# Altium schematic sheet schematic.SchDoc
size A
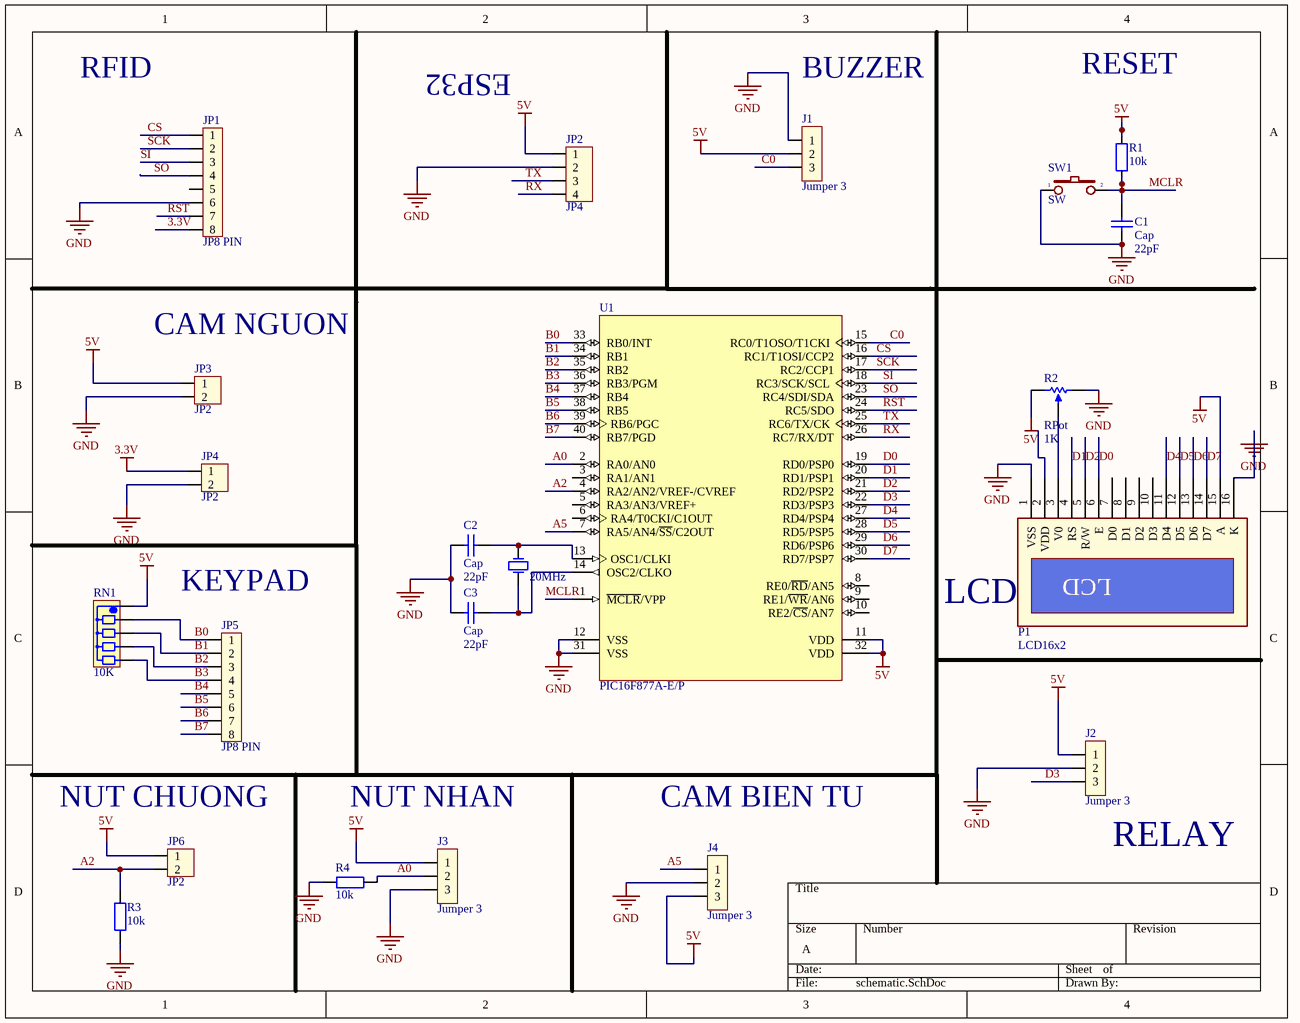
[diagram p0: schematic.SchDoc]

## Parts
C1  Cap  value 22pF  [RAD-0.3]
C2  Cap  value 22pF  [RAD-0.3]
C3  Cap  value 22pF  [RAD-0.3]
J1  Jumper 3  [JP3]
J2  Jumper 3  [JP3]
J3  Jumper 3  [JP3]
J4  Jumper 3  [JP3]
JP1  JP8 PIN  [JP8]
JP2  JP4  [CON4]
JP3  JP2  [CON2]
JP4  JP2  [CON2]
JP5  JP8 PIN  [JP8]
JP6  JP2  [CON2]
P1  LCD16x2  [LCD16X2]
R1  10k  [RES-1/4W]
R2  RPot  value 1K  [VR5]
R3  10k  [RES-1/4W]
R4  10k  [RES-1/4W]
RN1  10K  [RN4]
SW1  SW  [SW2]
U1  PIC16F877A-E/P  [DIP.100/40/W.600/L2.100]
Y1  20MHz  [XTAL]

## Nets
3.3V: JP1.8 JP4.1
5V: J1.2 J2.1 J3.1 J4.3 JP2.1 JP3.1 JP6.1 P1.15(A) R1.2 R2.1(TOP) RN1.1 U1.11(VDD) U1.32(VDD)
GND: C1.1 C2.1 C3.1 J1.1 J2.2 J3.3 J4.2 JP1.6 JP2.2 JP3.2 JP4.2 P1.1(VSS) P1.16(K) R2.2(BOT) R3.1 R4.2 SW1.1 U1.12(VSS) U1.31(VSS)
A0: J3.2 R4.1 U1.2(RA0/AN0)
A2: JP6.2 R3.2 U1.4(RA2/AN2/VREF-/CVREF)
A5: J4.1 U1.7(RA5/AN4/~{SS}/C2OUT)
B0: JP5.1 RN1.2 U1.33(RB0/INT)
B1: JP5.2 RN1.3 U1.34(RB1)
B2: JP5.3 RN1.4 U1.35(RB2)
B3: JP5.4 RN1.5 U1.36(RB3/PGM)
B4: JP5.5 U1.37(RB4)
B5: JP5.6 U1.38(RB5)
B6: JP5.7 U1.39(RB6/PGC)
B7: JP5.8 U1.40(RB7/PGD)
C0: J1.3 U1.15(RC0/T1OSO/T1CKI)
CS: JP1.1 U1.16(RC1/T1OSI/CCP2)
D0: P1.6(E) U1.19(RD0/PSP0)
D1: P1.4(RS) U1.20(RD1/PSP1)
D2: P1.5(R/W) U1.21(RD2/PSP2)
D3: J2.3 U1.22(RD3/PSP3)
D4: P1.11(D4) U1.27(RD4/PSP4)
D5: P1.12(D5) U1.28(RD5/PSP5)
D6: P1.13(D6) U1.29(RD6/PSP6)
D7: P1.14(D7) U1.30(RD7/PSP7)
MCLR: C1.2 R1.1 SW1.2 U1.1(~{MCLR}/VPP)
RST: JP1.7 U1.24(RC5/SDO)
RX: JP2.4 U1.26(RC7/RX/DT)
SCK: JP1.2 U1.17(RC2/CCP1)
SI: JP1.3 U1.18(RC3/SCK/SCL)
SO: JP1.4 U1.23(RC4/SDI/SDA)
TX: JP2.3 U1.25(RC6/TX/CK)
NetC2_2: C2.2 U1.13(OSC1/CLKI) Y1.2(OSC2)
NetC3_2: C3.2 U1.14(OSC2/CLKO) Y1.1(OSC1)
NetP1_3: P1.3(V0) R2.3(TAP)

Not connected (* = marked no-connect by the designer): JP1 5; P1 2(VDD) 7(D0) 8(D1) 9(D2) 10(D3); U1 3(RA1/AN1) 5(RA3/AN3/VREF+) 6(RA4/T0CKI/C1OUT) 8(RE0/~{RD}/AN5) 9(RE1/~{WR}/AN6) 10(RE2/~{CS}/AN7)

## Notes on the sheet
- RFID
- ESP32
- BUZZER
- RESET
- (near JP3) CAM NGUON
- KEYPAD
- LCD
- NUT CHUONG
- NUT NHAN
- CAM BIEN TU
- (near J2) RELAY
- (in symbol LCD Text) LCD

## Library data of the parts
C1-C3 = Cap: Capacitor; Published: 8-Jun-2000; LatestRevisionDate: 17-Jul-2002; LatestRevisionNote: Re-released for DXP Platform.; PackageReference: RAD-0.3; Publisher: Altium Limited; PackageDescription: Radial Cap, Thru-Hole; 2 Leads; 0.3 in Pin Spacing
J1-J4 = JP3: Value: J3
JP1 JP5 = JP8: Value: JP7
JP2 = Con4: Connector 4; Value: Connector 4
JP3 JP4 JP6 = Con2: Connector 2; Value: Connector 2
P1 = LCD Text
R1 R3 R4 = Tro 0603 1% 10k: Dán; Don_Vi: Con; So_Chan: 2; Ten_Linh_Kien: Trở 0603 1% 10k; Ma_Hang: MH006333; Chung_Loai: Dán; Kieu_Chan: *
R2 = RPot: Potentiometer; Sim Note: Enter the Resistance value and the set point into parameter fields.; Set Position: 0.5; Published: 8-Jun-2000; LatestRevisionDate: 17-Jul-2002; LatestRevisionNote: Re-released for DXP Platform.; PackageReference: VR5; Publisher: Altium Limited; PackageDescription: Variable Resistor, Thru-Hole; 3 Leads
RN1 = RN4: Resistor 4 (thanh); Value: Tro thanh 4K7
SW1 = SW2: Switch button 2 pin; Value: SW chip 2 pin
U1 = PIC16F877A-E/P: Enhanced FLASH Microcontroller, 8K (x14-Bit words) FLASH, 368 Bytes RAM, 40-Pin PDIP, Standard VDD Range, Extended Temperature; PackageDocument: 2003; Note: 25mA sink/source per I/O.; Published: 11-Oct-2004; LatestRevisionDate: 4-Mar-2005; LatestRevisionNote: Stylized 3D Model Added.; DatasheetDocument: DS39582B_2003; PackageReference: PDIP600-40; Publisher: Altium Limited; Code_JEDEC: MO-011; ComponentLink1Description: Manufacturer Link; ComponentLink1URL: http://www.microchip.com/index.asp; ComponentLink2Description: Datasheet; ComponentLink2URL: http://ww1.microchip.com/downloads/en/DeviceDoc/39582b.pdf; ComponentLink3Description: Packaging Specification; ComponentLink3URL: http://ww1.microchip.com/downloads/en/PackagingSpec/00049AD.pdf
Y1 = XTAL: Crystal Oscillator; Published: 8-Jun-2000; LatestRevisionDate: 17-Jul-2002; LatestRevisionNote: Re-released for DXP Platform.; PackageReference: R38; Publisher: Altium Limited